# Altium schematic sheet JS7628_base_power_v1.0.SchDoc
size A4
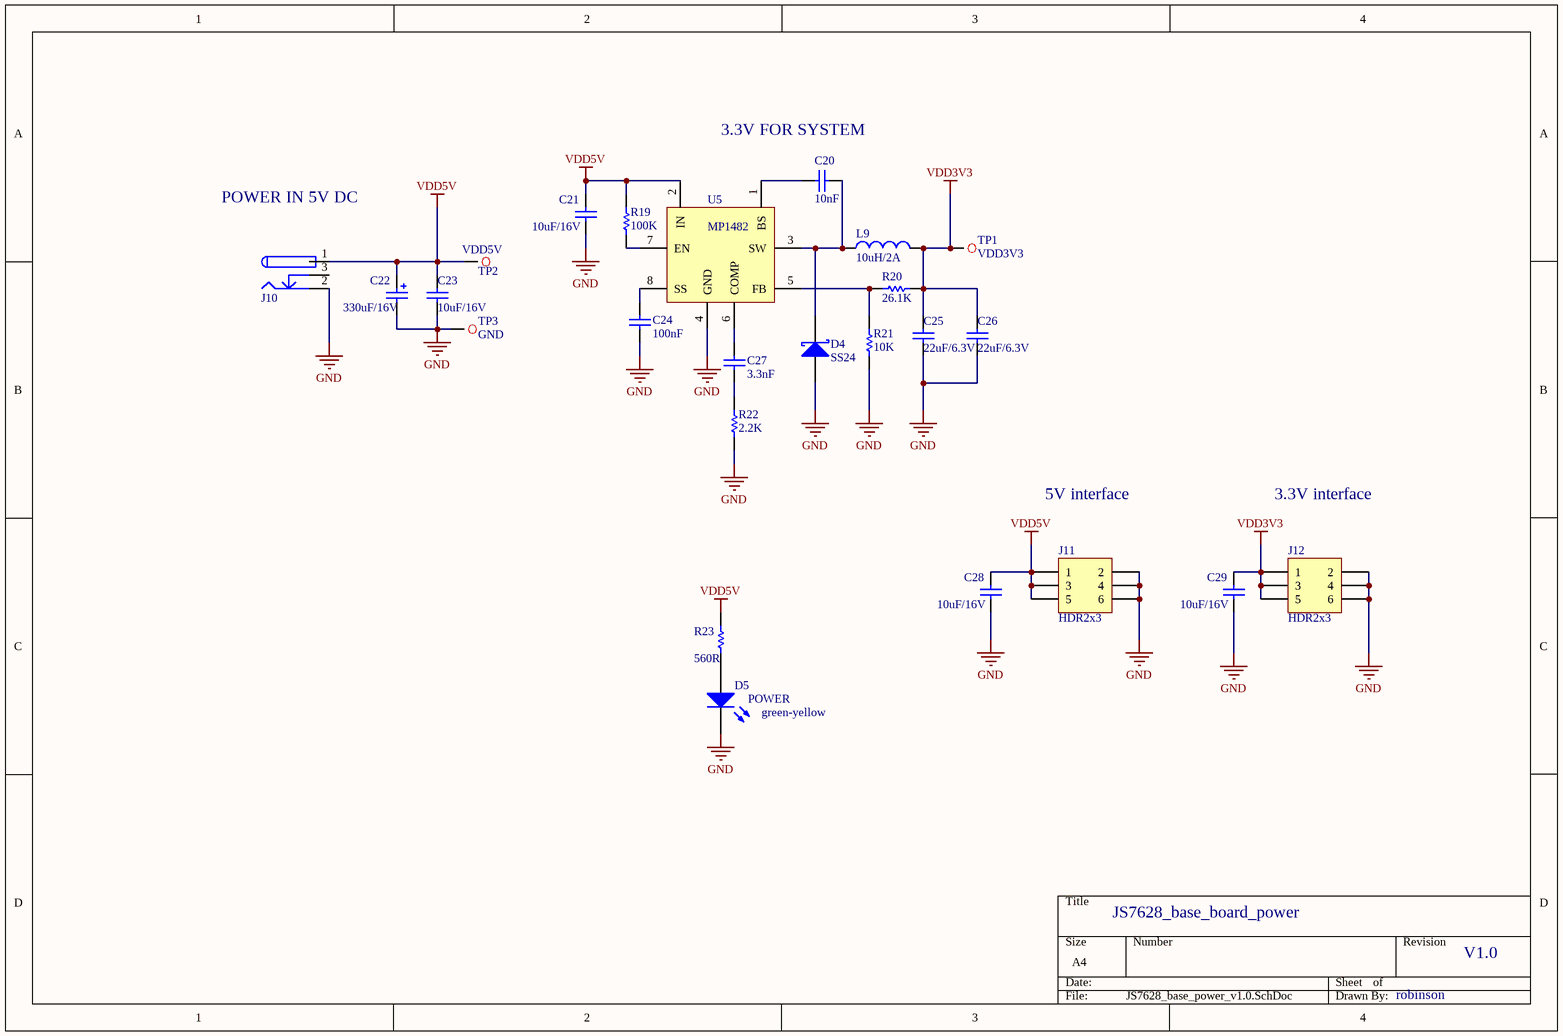
[diagram p0: JS7628_base_power_v1.0.SchDoc]

## Parts
C20  value 10nF  [0603]  (hidden comment: CAP-SMT)
C21  value 10uF/16V  [0603]  (hidden comment: CAP-SMT)
C22  value 330uF/16V  [RB2.5-6.5]  (hidden comment: cap-pol)
C23  value 10uF/16V  [0603]  (hidden comment: CAP-SMT)
C24  value 100nF  [0603]  (hidden comment: CAP-SMT)
C25  value 22uF/6.3V  [0603]  (hidden comment: CAP-SMT)
C26  value 22uF/6.3V  [0603]  (hidden comment: CAP-SMT)
C27  value 3.3nF  [0603]  (hidden comment: CAP-SMT)
C28  value 10uF/16V  [0603]  (hidden comment: CAP-SMT)
C29  value 10uF/16V  [0603]  (hidden comment: CAP-SMT)
D4  SS24  [SMB]
D5  POWER  value green-yellow  [0805-LED]
J10  DC-005  [DC-005]  (value not drawn)
J11  HDR2x3  [HDR2x3-2.54mm]
J12  HDR2x3  [HDR2x3-2.54mm]
L9  value 10uH/2A  [CDRH-7x7]  (hidden comment: inductor)
R19  value 100K  [0603]  (hidden comment: RES-SMT)
R20  value 26.1K  [0603]  (hidden comment: RES-SMT)
R21  value 10K  [0603]  (hidden comment: RES-SMT)
R22  value 2.2K  [0603]  (hidden comment: RES-SMT)
R23  value 560R  [0603]  (hidden comment: RES-SMT)
TP1  VDD3V3  [Test Point]
TP2  VDD5V  [Test Point]
TP3  GND  [Test Point]
U5  MP1482  [SOIC-8P]

## Nets
GND: C21.1 C22.2 C23.1 C24.1 C25.1 C26.1 C28.1 C29.1 D4.1(A) D5.2(K) J10.2 J11.2 J11.4 J11.6 J12.2 J12.4 J12.6 R21.2 R22.1 TP3.1 U5.4(GND)
VDD3V3: C25.2 C26.2 C29.2 J12.1 J12.3 J12.5 L9.2 R20.1 TP1.1
VDD5V: C21.2 C22.1 C23.2 C28.2 J10.1 J11.1 J11.3 J11.5 R19.1 R23.2 TP2.1 U5.2(IN)
NetC20_1: C20.1 U5.1(BS)
NetC20_2: C20.2 D4.2(K) L9.1 U5.3(SW)
NetC24_2: C24.2 U5.8(SS)
NetC27_1: C27.1 R22.2
NetC27_2: C27.2 U5.6(COMP)
NetD5_1: D5.1(A) R23.1
NetR19_2: R19.2 U5.7(EN)
NetR20_2: R20.2 R21.1 U5.5(FB)

Not connected (* = marked no-connect by the designer): J10 3

## Notes on the sheet
- (near C20) 3.3V FOR SYSTEM
- POWER IN 5V DC
- 5V interface
- 3.3V interface
- JS7628_base_board_power
- V1.0
- robinson

## Library data of the parts
D5 = LED
TP1-TP3 = Test Point